# EAGLE design Sens_BMP085 (EAGLE 6.3)
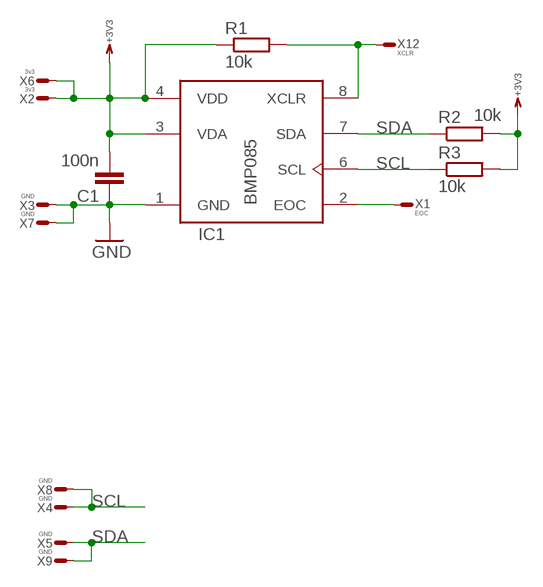
[diagram p0: schematic, sheet 1]

## Parts
C1  100n  C0603  [0603]
IC1  BMP085  [LCC8]
R1  10k  R0603  [0603]
R2  10k  R0603  [0603]
R3  10k  R0603  [0603]
X1  EOC  WIREPADR  [S1.27R]
X2  3v3  WIREPADT1.6/0.9  [T1.6/0.9]
X3  GND  WIREPADT1.6/0.9  [T1.6/0.9]
X4  GND  WIREPADT1.6/0.9  [T1.6/0.9]
X5  GND  WIREPADT1.6/0.9  [T1.6/0.9]
X6  3v3  WIREPADT1.6/0.9  [T1.6/0.9]
X7  GND  WIREPADT1.6/0.9  [T1.6/0.9]
X8  GND  WIREPADT1.6/0.9  [T1.6/0.9]
X9  GND  WIREPADT1.6/0.9  [T1.6/0.9]
X12  XCLR  WIREPADR  [S1.27R]

## Nets
+3V3: C1.2 IC1.3(VDA) IC1.4(VDD) R1.1 R2.2 R3.2 X2.1(S) X6.1(S)
EOC: IC1.2(EOC) X1.1(S)
GND: C1.1 IC1.1(GND) X3.1(S) X7.1(S)
SCL: IC1.6(SCL) R3.1 X4.1(S) X8.1(S)
SDA: IC1.7(SDA) R2.1 X5.1(S) X9.1(S)
XCLR: IC1.8(XCLR) R1.2 X12.1(S)

## Library data of the parts
C1 = RCL:C: Capacitor SMD
IC1 = Sensors:BMP085
R1-R3 = RCL:R: Resistor SMD
X1-X9 X12 = Conn:WIREPAD: Wire PAD connect wire on PCB

## Board
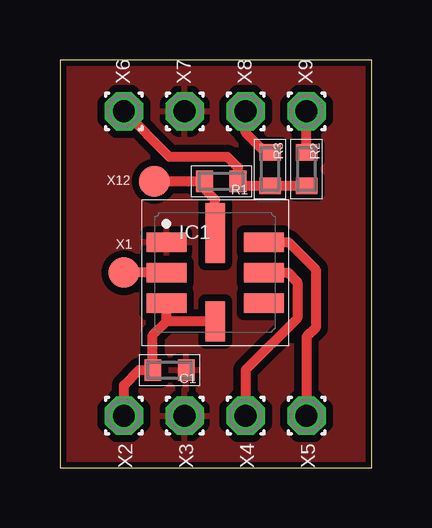
[diagram p1: board, top side]
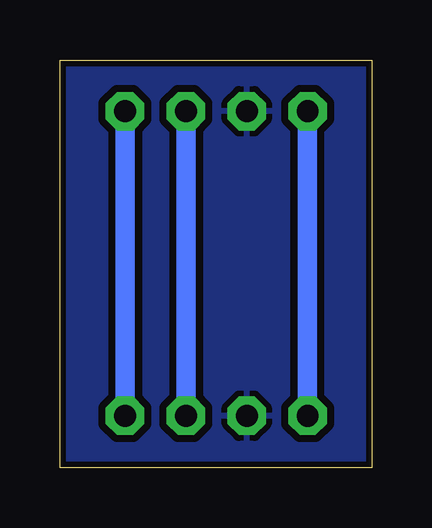
[diagram p2: board, bottom side, seen from below]

Size 13 x 17 mm. Coordinates in mm from the lower left corner, seen from the top.
Outline: 0,0 13,0 13,17 0,17 0,0
Copper layers (1*16): Top 0.035mm / dielectric 1.5mm / Bottom 0.035mm
Design rules "default": minimum track width 10mil, minimum drill 12mil, track to track 12mil, track to pad 12mil, pad to pad 12mil, via to via 12mil, smd to smd 12mil, copper to edge 10mil, drill to drill 8mil, minimum pad ring 10mil, minimum via ring 8mil, stop-mask expansion 4mil, vias tented up to drill 0mil, thermal gap 10mil

### Footprints (pad centres in the part's own frame; a part is rotated, then mirrored left to right if it is on the bottom)
0603 = smd 0.7 x 0.9: 1 -0.697,0; 2 0.697,0
LCC8 = smd 1.67 x 0.8: 1 -2.032,1.27; 2 -2.032,0; 3 -2.032,-1.27; 5 2.032,-1.27; 6 2.032,0; 7 2.032,1.27 | smd 0.8 x 1.67: 4 0,-2.032 | smd 0.8 x 2.5: 8 0,1.651
S1.27R = smd 1.27 x 1.27: 1 0,0
T1.6/0.9 = drill 0.914 pad 1.6 octagon: 1 0,0

### Placement (x,y rotation side)
C1  4.57,4.06 180 top
IC1  6.48,8.13 0 top
R1  6.73,11.94 180 top
R2  10.29,12.45 270 top
R3  8.76,12.45 270 top
X1  2.67,8.13 0 top
X2  2.67,2.16 270 top
X3  5.21,2.16 270 top
X4  7.75,2.16 270 top
X5  10.29,2.16 270 top
X6  2.67,14.86 90 top
X7  5.21,14.86 90 top
X8  7.75,14.86 90 top
X9  10.29,14.86 90 top
X12  3.94,11.94 0 top

### Tracks (layer width: path | path; a pad name or v marks a point on that pad's centre or on a via)
+3V3
  Top 0.406: IC1.4 4.57,6.1 4.51,6.16 | 4.51,6.16 4.45,6.22 IC1.3 | X6.1 4.57,12.95 6.99,12.95 7.43,12.51 R1.1 7.62,11.75 R3.2 R2.2 | X2.1 2.67,3.43 3.3,4.06 C1.2 3.88,5.53 4.51,6.16
  Bottom 0.813: X2.1 X6.1
EOC
  Top 0.406: IC1.2 X1.1
GND
  pour Top: 0,17 13,17 13,0 0,0
  pour Bottom: 0,0 13,0 13,17 0,17
SCL
  Top 0.406: R3.1 8.57,13.14 7.75,13.97 X8.1 | IC1.6 9.53,8.13 9.91,7.75 9.91,6.22 7.75,4.06 X4.1
  Bottom 0.813: X8.1 X4.1
SDA
  Top 0.406: R2.1 X9.1 | IC1.7 9.53,9.4 10.67,8.26 10.67,5.84 10.29,5.46 X5.1
  Bottom 0.813: X9.1 X5.1
XCLR
  Top 0.406: X12.1 R1.2 6.1,11.88 6.1,11.56 6.48,11.18 IC1.8